# Altium schematic sheet rev.SchDoc
size A4
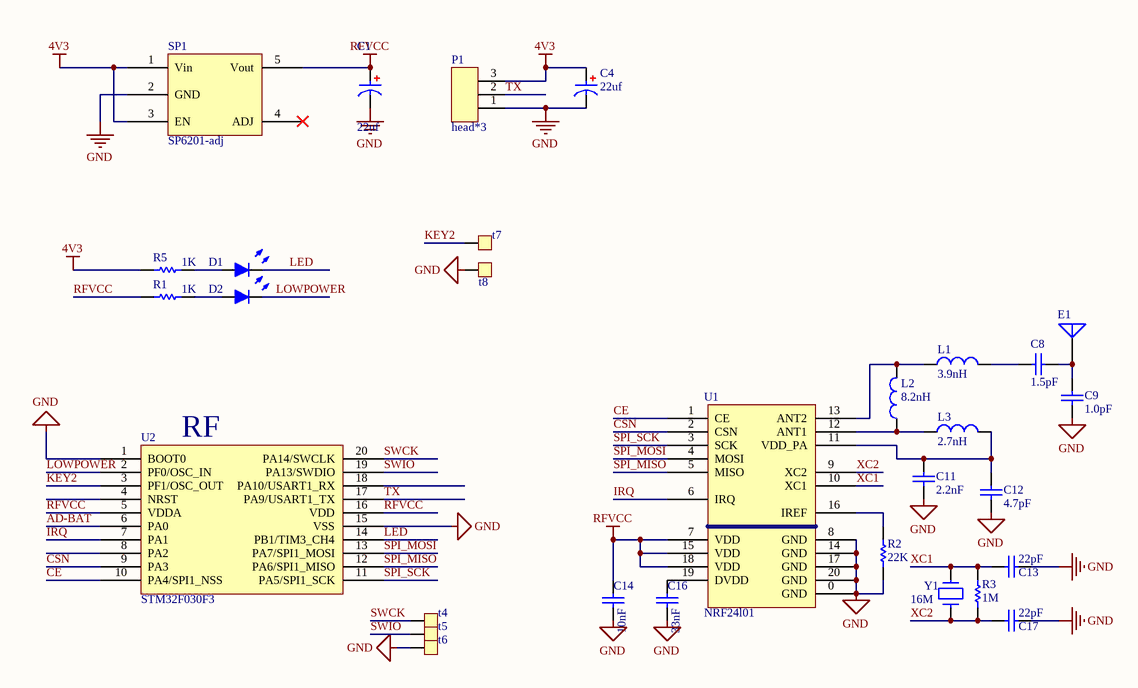
[diagram p0: rev.SchDoc]

## Parts
C1  22uf  [0603R]
C4  22uf  [0603R]
C8  1.5pF  [0402]
C9  1.0pF  [0402]
C11  2.2nF  [0402]
C12  4.7pF  [0402]
C13  22pF  [0402]
C14  10nF  [0402]
C16  33nF  [0402]
C17  22pF  [0402]
D1  LED-R  [LED]  (value not drawn)
D2  LED-G  [LED]  (value not drawn)
E1  Antenna  [ANT6520]  (value not drawn)
L1  3.9nH  [0402]
L2  8.2nH  [0402]
L3  2.7nH  [0402]
P1  head*3  [head*3 - duplicate]
R1  R1K  [0402]  (value not drawn)
R2  22K  [0402]
R3  R1M  [0402]  (value not drawn)
R5  R1K  [0402]  (value not drawn)
SP1  SP6201-adj  [SOT23-5]
t4  TP  [TESTPOINT]  (value not drawn)
t5  TP  [TESTPOINT]  (value not drawn)
t6  TP  [TESTPOINT]  (value not drawn)
t7  TP  [TESTPOINT]  (value not drawn)
t8  TP  [TESTPOINT]  (value not drawn)
U1  NRF24l01  [QFN20-4X4]
U2  STM32F030F3  [TSSOP20]
Y1  16M  [XTAL3225]

## Nets
4V3: C4.1 P1.3 R5.1 SP1.1(Vin) SP1.3(EN)
GND: C1.2 C4.2 C9.1 C11.1 C12.1 C13.1 C14.1 C16.1 C17.1 P1.1 R2.2 SP1.2(GND) t6.1(R) t8.1(R) U1.0(GND) U1.8(GND) U1.14(GND) U1.17(GND) U1.20(GND) U2.1(BOOT0) U2.15(VSS)
RFVCC: C1.1 C14.2 R1.1 SP1.5(Vout) U1.7(VDD) U1.15(VDD) U1.18(VDD) U2.5(VDDA) U2.16(VDD)
AD-BAT: U2.6(PA0)
CE: U1.1(CE) U2.10(PA4/SPI1_NSS)
CSN: U1.2(CSN) U2.9(PA3)
IRQ: U1.6(IRQ) U2.7(PA1)
KEY2: t7.1(R) U2.3(PF1/OSC_OUT)
LED: D1.2(K) U2.14(PB1/TIM3_CH4)
LOWPOWER: D2.2(K) U2.2(PF0/OSC_IN)
SPI_MISO: U1.5(MISO) U2.12(PA6/SPI1_MISO)
SPI_MOSI: U1.4(MOSI) U2.13(PA7/SPI1_MOSI)
SPI_SCK: U1.3(SCK) U2.11(PA5/SPI1_SCK)
SWCK: t4.1(R) U2.20(PA14/SWCLK)
SWIO: t5.1(R) U2.19(PA13/SWDIO)
TX: P1.2 U2.17(PA9/USART1_TX)
XC1: C13.2 R3.1 U1.10(XC1) Y1.3
XC2: C17.2 R3.2 U1.9(XC2) Y1.1
NetC8_1: C8.1 L1.2
NetC8_2: C8.2 C9.2 E1.1(A)
NetC11_2: C11.2 C12.2 L3.1 U1.11(VDD_PA)
NetC16_2: C16.2 U1.19(DVDD)
NetD1_1: D1.1(A) R5.2
NetD2_1: D2.1(A) R1.2
NetL1_1: L1.1 L2.2 U1.13(ANT2)
NetL2_1: L2.1 L3.2 U1.12(ANT1)
NetR2_1: R2.1 U1.16(IREF)

Not connected (* = marked no-connect by the designer): SP1 4(ADJ)*; U2 4(NRST) 8(PA2) 18(PA10/USART1_RX)

## Notes on the sheet
- (near U2) RF
- (in symbol R1K) 1K
- (in symbol R10K) 1M

## Library data of the parts
C1 C4 = C100uF
C8 C9 C11-C14 C16 C17 = C0.1uF
D1 D2 = LED
E1 = Antenna: Generic Antenna; Published: 24-Mar-1999; LatestRevisionDate: 17-Jul-2002; LatestRevisionNote: Re-released for DXP Platform.; PackageReference: PIN1; Publisher: Altium Limited
L1-L3 = Inductor-100uH
R2 R3 = R10K
SP1 = SP6201
U2 = STM32F030F4
Y1 = CRYSTAL